# EAGLE design ECG AFE (EAGLE 7.6.0)
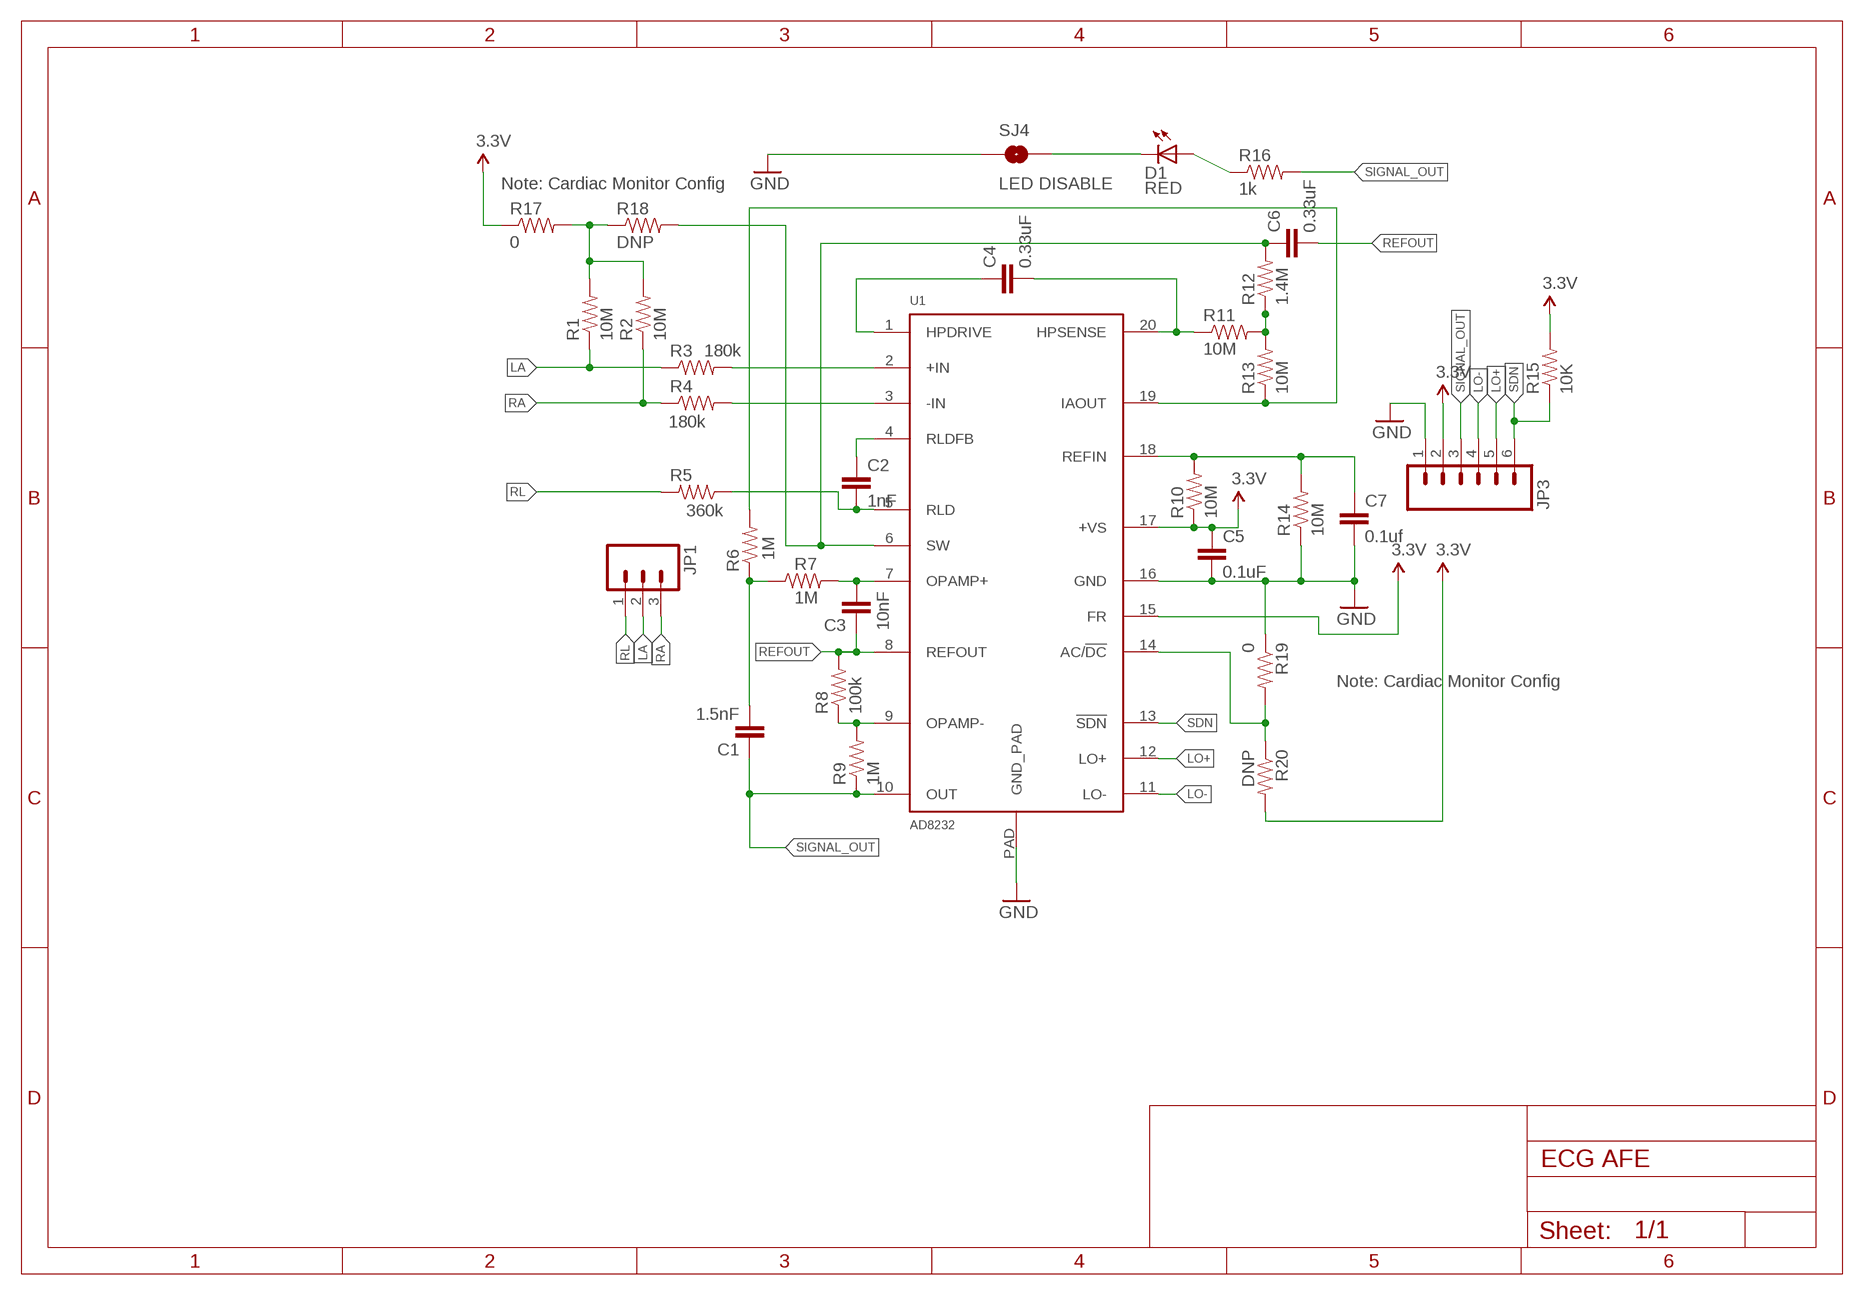
[diagram p0: schematic, sheet 1]

## Parts
C1  1.5nF  CAP0603-CAP  [0603-CAP]
C2  1nF  CAP0603-CAP  [0603-CAP]
C3  10nF  CAP0603-CAP  [0603-CAP]
C4  0.33uF  CAP0805  [0805]
C5  0.1uF  CAP0603-CAP  [0603-CAP]
C6  0.33uF  CAP0805  [0805]
C7  0.1uf  CAP0603-CAP  [0603-CAP]
D1  RED  LED-RED0603  [LED-0603]
JP1  M03PTH  [1X03]
JP3  M06SIP  [1X06]
R1  10M  RESISTOR0603-RES  [0603-RES]
R2  10M  RESISTOR0603-RES  [0603-RES]
R3  180k  RESISTOR0603-RES  [0603-RES]
R4  180k  RESISTOR0603-RES  [0603-RES]
R5  360k  RESISTOR0603-RES  [0603-RES]
R6  1M  RESISTOR0603-RES  [0603-RES]
R7  1M  RESISTOR0603-RES  [0603-RES]
R8  100k  RESISTOR0603-RES  [0603-RES]
R9  1M  RESISTOR0603-RES  [0603-RES]
R10  10M  RESISTOR0603-RES  [0603-RES]
R11  10M  RESISTOR0603-RES  [0603-RES]
R12  1.4M  RESISTOR0603-RES  [0603-RES]
R13  10M  RESISTOR0603-RES  [0603-RES]
R14  10M  RESISTOR0603-RES  [0603-RES]
R15  10K  10KOHM1/10W1%(0603)0603  [0603-RES]
R16  1k  1K-1%  [0603-RES]
R17  0  0OHM1/10W5%(0603)  [0603]
R18  DNP  0OHM1/10W5%(0603)  [0603]
R19  0  0OHM1/10W5%(0603)  [0603]
R20  DNP  0OHM1/10W5%(0603)  [0603]
SJ4  LED DISABLE  SOLDERJUMPERTRACE  [SJ_2S-TRACE]
U1  AD8232  [LFCSP_20]

## Nets
3.3V: C5.1 JP3.2 R10.1 R15.2 R17.1 R20.2 U1.15(FR) U1.17(+VS)
GND: C5.2 C7.2 JP3.1 R14.1 R19.1 SJ4.1 U1.16(GND) U1.PAD(GND_PAD)
LA: JP1.2 R1.1 R3.1
LO+: JP3.5 U1.12(LO+)
LO-: JP3.4 U1.11(LO-)
N$1: R3.2 U1.2(+IN)
N$2: R4.2 U1.3(-IN)
N$3: C3.2 R7.2 U1.7(OPAMP+)
N$4: C4.2 R11.1 U1.20(HPSENSE)
N$5: C7.1 R10.2 R14.2 U1.18(REFIN)
N$6: D1.A R16.1
N$7: R8.1 R9.2 U1.9(OPAMP-)
N$8: R6.2 R13.1 U1.19(IAOUT)
N$9: C1.2 R6.1 R7.1
N$10: D1.C SJ4.2
N$11: R19.2 R20.1 U1.14(AC/!DC)
N$13: C4.1 U1.1(HPDRIVE)
N$14: R11.2 R12.1 R13.2
N$16: C6.1 R12.2 R18.2 U1.6(SW)
N$17: C2.1 U1.4(RLDFB)
N$18: C2.2 R5.1 U1.5(RLD)
N$20: R1.2 R2.2 R17.2 R18.1
RA: JP1.3 R2.1 R4.1
REFOUT: C3.1 C6.2 R8.2 U1.8(REFOUT)
RL: JP1.1 R5.2
SDN: JP3.6 R15.1 U1.13(!SDN)
SIGNAL_OUT: C1.1 JP3.3 R9.1 R16.2 U1.10(OUT)

## Notes on the sheet
- Note: Cardiac Monitor Config
- Note: Cardiac Monitor Config

## Library data of the parts
C1-C7 = SparkFun-Passives:CAP: Capacitor Standard 0603 ceramic capacitor, and 0.1" leaded capacitor.
D1 = SparkFun-LED:LED-RED: Assorted Red LEDs LilyPad 1206- DIO-09912 1206- DIO-00809 0603- DIO-00819; PROD_ID: DIO-00819
JP1 = SparkFun-Connectors:M03: Header 3 Standard 3-pin 0.1" header. Use with straight break away headers (SKU : PRT-00116), right angle break away headers (PRT-00553), swiss pins (PRT-00743), machine pins (PRT-00117), and female headers (PRT-00115). Molex polarized connector foot print use with SKU : PRT-08232 with associated crimp pins and housings.
JP3 = SparkFun-Connectors:M06: Header 6 Standard 6-pin 0.1" header. Use with straight break away headers (SKU : PRT-00116), right angle break away headers (PRT-00553), swiss pins (PRT-00743), machine pins (PRT-00117), and female headers (PRT-00115). Molex polarized connector foot print use with SKU : PRT-08094 with associated crimp pins and housings. NOTES ON THE VARIANTS LOCK and LOCK_LONGPADS... This footprint was designed to help hold the alignment of a through-hole component (i.e. 6-pin header) while soldering it into place. You may notice that each hole has been shifted either up or down by 0.005 of an inch from it's more standard position (which is a perfectly straight line). This slight alteration caused the pins (the squares in the middle) to touch the edges of the holes. Because they are alternating, it causes a "brace" to hold the component in place. 0.005 has proven to be the perfect amount of "off-center" position when using our standard breakaway headers. Although looks a little odd when you look at the bare footprint, once you have a header in there, the alteration is very hard to notice. Also,if you push a header all the way into place, it is covered up entirely on the bottom side. This idea of altering the position of holes to aid alignment will be further integrated into the Sparkfun Library for other footprints. It can help hold any component with 3 or more connection pins.
R1-R14 = SparkFun-Passives:RESISTOR: Resistor Basic schematic elements and footprints for 0603, 1206, and PTH resistors.
R15 = SparkFun-Resistors:10KOHM1/10W1%(0603): RES-00824; PROD_ID: RES-00824
R16 = SparkFun-Resistors:1K-1%: 1k-ohm SMT 1/10W - 1% (0603) RES-07856; PROD_ID: RES-07856
R17 R19 = SparkFun-Resistors:0OHM1/10W5%(0603): RES-08609; PROD_ID: RES-08609
R18 R20 = SparkFun-Resistors:0OHM1/10W5%(0603): RES-08609; PROD_ID: RES-08609; VALUE: 0
SJ4 = SparkFun-Passives:SOLDERJUMPER: Solder Jumper Standard SMD solder jumper. Used to automate production. Two varients : Normally Open and Normally Closed are the same, but have different paste layers. NC will have a large amount of paste and should jumper during reflow.
U1 = AD8232:AD8232

## Board
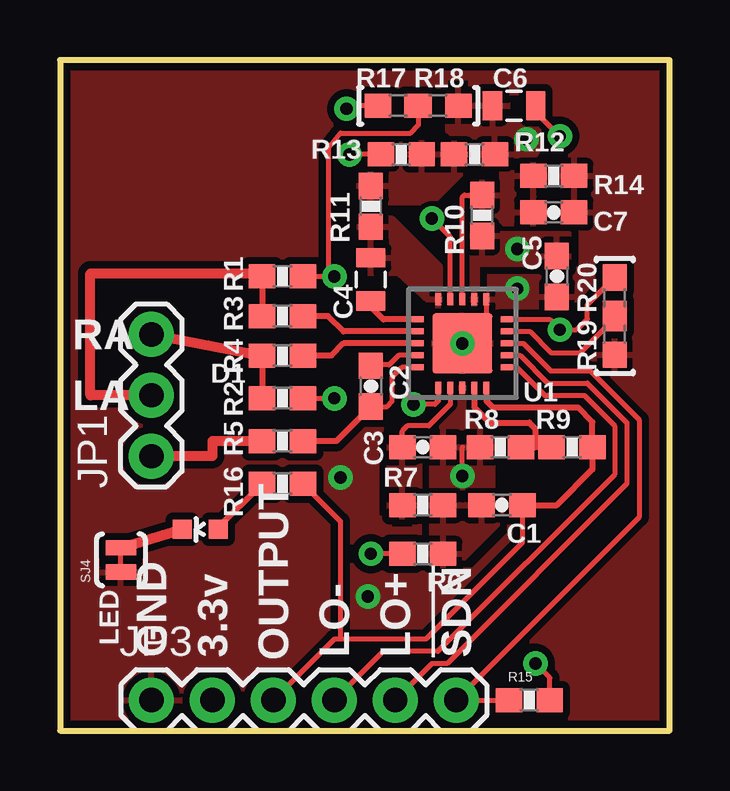
[diagram p1: board, top side]
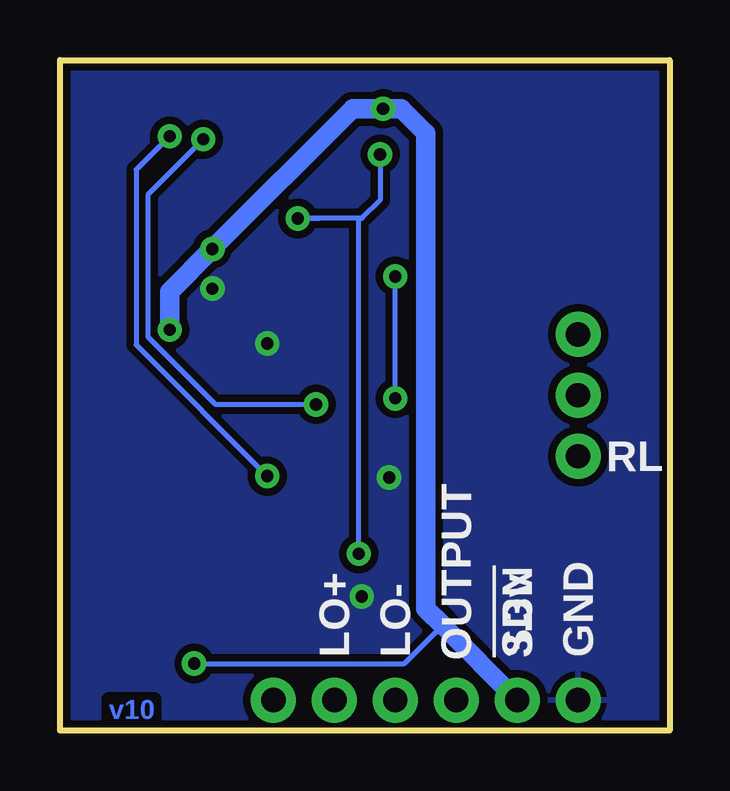
[diagram p2: board, bottom side, seen from below]

Size 25.4 x 27.94 mm. Coordinates in mm from the lower left corner, seen from the top.
Outline: 25.4,0 25.4,27.94 0,27.94 0,0 25.4,0
Copper layers (1*16): Top 0.035mm / dielectric 1.5mm / Bottom 0.035mm
Design rules "default": minimum track width 7mil, minimum drill 15mil, track to track 6mil, track to pad 8mil, pad to pad 8mil, via to via 8mil, smd to smd 8mil, copper to edge 8mil, drill to drill 8mil, minimum pad ring 12mil, minimum via ring 10mil, stop-mask expansion 4mil, vias tented up to drill 20mil, thermal gap 10mil

### Footprints (pad centres in the part's own frame; a part is rotated, then mirrored left to right if it is on the bottom)
0603-CAP = smd 1.1 x 1: 1 -0.85,0; 2 0.85,0
0805 = smd 0.8 x 1.2: 1 -0.9,0; 2 0.9,0
LED-0603 = smd 0.8 x 0.8: A 0,-0.75; C 0,0.75
1X03 = drill 1.016 pad 1.88: 1 0,0; 2 2.54,0; 3 5.08,0
1X06 = drill 1.016 pad 1.88: 1 0,0; 2 2.54,0; 3 5.08,0; 4 7.62,0; 5 10.16,0; 6 12.7,0
0603-RES = smd 1.1 x 1: 1 -0.85,0; 2 0.85,0
0603 = smd 1.1 x 1: 1 -0.85,0; 2 0.85,0
SJ_2S-TRACE = smd 0.635 x 1.27: 1 -0.508,0; 2 0.508,0
LFCSP_20 = smd 0.5 x 0.25: 1 -1.85,1; 2 -1.85,0.5; 3 -1.85,0; 4 -1.85,-0.5; 5 -1.85,-1; 11 1.85,-1; 12 1.85,-0.5; 13 1.85,0; 14 1.85,0.5; 15 1.85,1 | smd 0.25 x 0.5: 6 -1,-1.85; 7 -0.5,-1.85; 8 0,-1.85; 9 0.5,-1.85; 10 1,-1.85; 16 1,1.85; 17 0.5,1.85; 18 0,1.85; 19 -0.5,1.85; 20 -1,1.85 | smd 2.5 x 2.5: PAD 0,0

### Placement (x,y rotation side)
C1  18.41,9.4 180 top
C2  12.95,14.35 270 top
C3  15.11,11.81 180 top
C4  12.95,18.8 90 top
C5  20.7,18.92 270 top
C6  18.92,26.04 0 top
C7  20.57,21.59 0 top
D1  5.84,8.38 90 top
JP1  3.81,11.43 90 top
JP3  3.81,1.27 0 top
R1  9.27,18.92 0 top
R2  9.27,13.84 0 top
R3  9.27,17.27 0 top
R4  9.27,15.62 0 top
R5  9.27,12.06 180 top
R6  15.11,7.37 180 top
R7  15.11,9.4 180 top
R8  18.35,11.81 180 top
R9  21.34,11.81 180 top
R10  17.59,21.46 90 top
R11  12.95,21.84 90 top
R12  17.27,24 0 top
R13  14.22,24 0 top
R14  20.57,23.11 180 top
R15  19.56,1.27 0 top
R16  9.27,10.29 0 top
R17  14.1,26.04 0 top
R18  15.75,26.04 0 top
R19  23.11,16.51 90 top
R20  23.11,18.03 90 top
SJ4  2.54,7.11 90 top
U1  16.76,16.13 0 top

### Tracks (layer width: path | path; a pad name or v marks a point on that pad's centre or on a via)
3.3V  (via drill 0.51, 0.51 pad 0.3)
  Top 0.203: R15.2 20.41,2.2 v19.81,2.79 | U1.15 20.4,17.13 v20.83,16.7 21.53,16.7 21.97,17.14 21.97,17.74 R20.2 | R17.1 12.06,26.04 v11.94,25.91
  Bottom 0.203: v19.81,2.79 11.05,2.79 9.46,4.38
  Bottom 0.813: v20.83,16.7 20.83,18.29 v19.05,20.07 13.21,25.91 v11.94,25.91 11.18,25.91 10.16,24.89 10.16,5.08 9.46,4.38 JP3.2
  pour Top (isolate 0.203): 17.14,17.78 17.4,17.78 17.4,19.43 21.21,19.43 21.21,20.7 17.14,20.7
GND  (via drill 0.51)
  Top 0.203: 17.26,16.63 U1.PAD 17.76,17.13 U1.16
  other vias: 19.05,18.41 16.76,16.13 12.83,5.59 11.68,10.54
  pour Top (isolate 0.305, rank 6): 0,27.94 25.4,27.94 25.4,0 0,0
  pour Bottom (isolate 0.305, rank 6): 0,27.94 25.4,27.94 25.4,0 0,0
LA
  Top 0.254: R1.1 R3.1
  Top 0.406: JP1.2 1.27,13.97 1.27,19.05 8.42,19.05 R1.1
LO+
  Top 0.203: U1.12 19.17,15.63 20.32,14.48 21.97,14.48 23.62,12.83 23.62,10.29 16.13,2.79 15.49,2.79 JP3.5
LO-
  Top 0.203: U1.11 19.03,15.13 20.19,13.97 21.84,13.97 23.11,12.7 23.11,10.67 15.75,3.3 13.46,3.3 JP3.4
N$1
  Top 0.254: U1.2 11.82,16.63 11.18,17.27 R3.2
N$2
  Top 0.254: U1.3 11.81,16.13 11.3,15.62 R4.2
N$3
  Top 0.203: U1.7 16.26,13.6 15.37,12.7 14.48,12.7 14.26,12.48 C3.2
  pour Top (isolate 0.203): 13.72,12.32 14.99,12.32 14.99,8.89 13.72,8.89
N$4
  pour Top (isolate 0.203): 15.88,17.65 15.88,19.3 13.84,21.34 12.45,21.34 12.45,19.05 14.1,19.05 15.62,17.65
N$5
  Top 0.203: U1.18 16.76,22.23 16.85,22.31 R10.2
  pour Top (isolate 0.203, rank 2): 18.41,23.62 20.19,23.62 20.19,21.08 18.54,21.08 18.16,21.46 17.14,21.46 17.14,22.86 18.41,22.86
N$6
  Top 0.254: D1.A 6.52,8.38 R16.1
N$7
  Top 0.254: U1.9 17.26,13.47 17.91,12.83 19.56,12.83 19.81,12.57 19.81,11.81 | R8.1 19.81,11.81 | R9.2 19.81,11.81
N$8  (via drill 0.51)
  Top 0.203: U1.19 16.26,20.57 v15.49,21.34 | R13.1 v12.06,24 | R6.2 v12.95,7.37
  Bottom 0.203: 14.61,21.34 v15.49,21.34 12.95,21.34 | 12.95,21.34 12.83,21.34 12.06,22.1 v12.06,24 | v12.95,7.37 12.95,21.34
N$9
  pour Top (isolate 0.203): 15.49,9.78 18.41,9.78 18.41,8.76 16.51,6.86 15.49,6.86
N$10
  Top 0.406: SJ4.2 D1.C
N$11
  Top 0.203: U1.14 19.57,16.63 20.45,15.75 21.68,15.75 R20.1 R19.2
N$13
  Top 0.254: U1.1 13.48,17.13 12.95,17.65 C4.1
N$14
  pour Top (isolate 0.203, rank 2): 14.22,24.51 17.02,24.51 17.02,23.5 15.49,21.97 12.45,21.97 12.45,23.37 14.22,23.37
N$16  (via drill 0.51)
  Top 0.203: 18.16,24 R12.2 | U1.6 15.76,13.73 15.62,13.59 v14.73,13.59
  Bottom 0.203: v19.43,24.64 21.72,22.35 21.72,16.38 18.92,13.59 v14.73,13.59
  pour Top (isolate 0.254): 17.65,23.75 19.68,23.75 20.07,24.38 20.07,24.89 19.68,25.27 18.8,25.27 18.67,25.4 18.67,26.42 17.02,26.42 16.76,26.67 16.13,26.67 16.13,25.02
N$17
  Top 0.203: U1.4 14.11,15.63 13.72,15.24 12.95,15.24 C2.1
N$18
  Top 0.203: C2.2 13.63,13.5 13.84,13.72 13.84,14.73 14.24,15.13 U1.5 | R5.1 10.16,12.06
  Top 0.254: C2.2 11.52,12.06 10.16,12.06
N$20  (via drill 0.51)
  Top 0.203: R2.2 v11.43,13.84 | R1.2 v11.43,18.92 11.18,19.18 11.18,24.26 11.68,24.89 14.61,24.89 14.95,25.23 R17.2 R18.1
  Bottom 0.203: v11.43,13.84 v11.43,18.92
RA
  Top 0.254: R4.1 R2.1
  Top 0.406: JP1.3 R4.1
REFOUT  (via drill 0.51)
  Top 0.203: C6.2 19.81,25.78 v20.83,24.77 | v16.76,10.6 16.76,11.81
  Top 0.254: R8.2 17.53,11.94
  Bottom 0.203: v20.83,24.77 22.22,23.37 22.22,16.07 v16.76,10.6
  pour Top (isolate 0.203, rank 2): 16.51,14.48 17.02,14.48 17.02,13.08 17.53,12.57 18.03,12.57 18.03,10.03 15.49,10.03 15.49,12.45 16.51,13.46
RL
  Top 0.406: R5.2 6.35,12.06 6.35,11.43 JP1.1
SDN
  Top 0.203: U1.13 19.3,16.13 20.45,14.99 22.1,14.99 24.13,12.95 24.13,8.89 JP3.6 R15.1
SIGNAL_OUT
  Top 0.203: C1.1 19.27,7.83 15.24,3.81 11.68,3.81 | 11.68,3.81 11.43,3.81 JP3.3 | R16.2 11.68,8.72 11.68,3.81
  Top 0.254: U1.10 17.76,13.73 18.03,13.46 21.59,13.46 22.19,12.87 R9.1 22.19,10.88 20.7,9.4 C1.1

### Text on the board
Bottom: v10
tPlace: RA | LA | LED | GND | 3.3v | OUTPUT | LO- | LO+ | !SDN
bPlace: RL | GND | !SDN | 3.3v | OUTPUT | LO- | LO+